# EasyEDA schematic 1-Schematic_New Project.json
TITLE: Sheet_1; REV: 1.0; Date: 2025-03-11; Sheet: 1/1; Company: Your Company
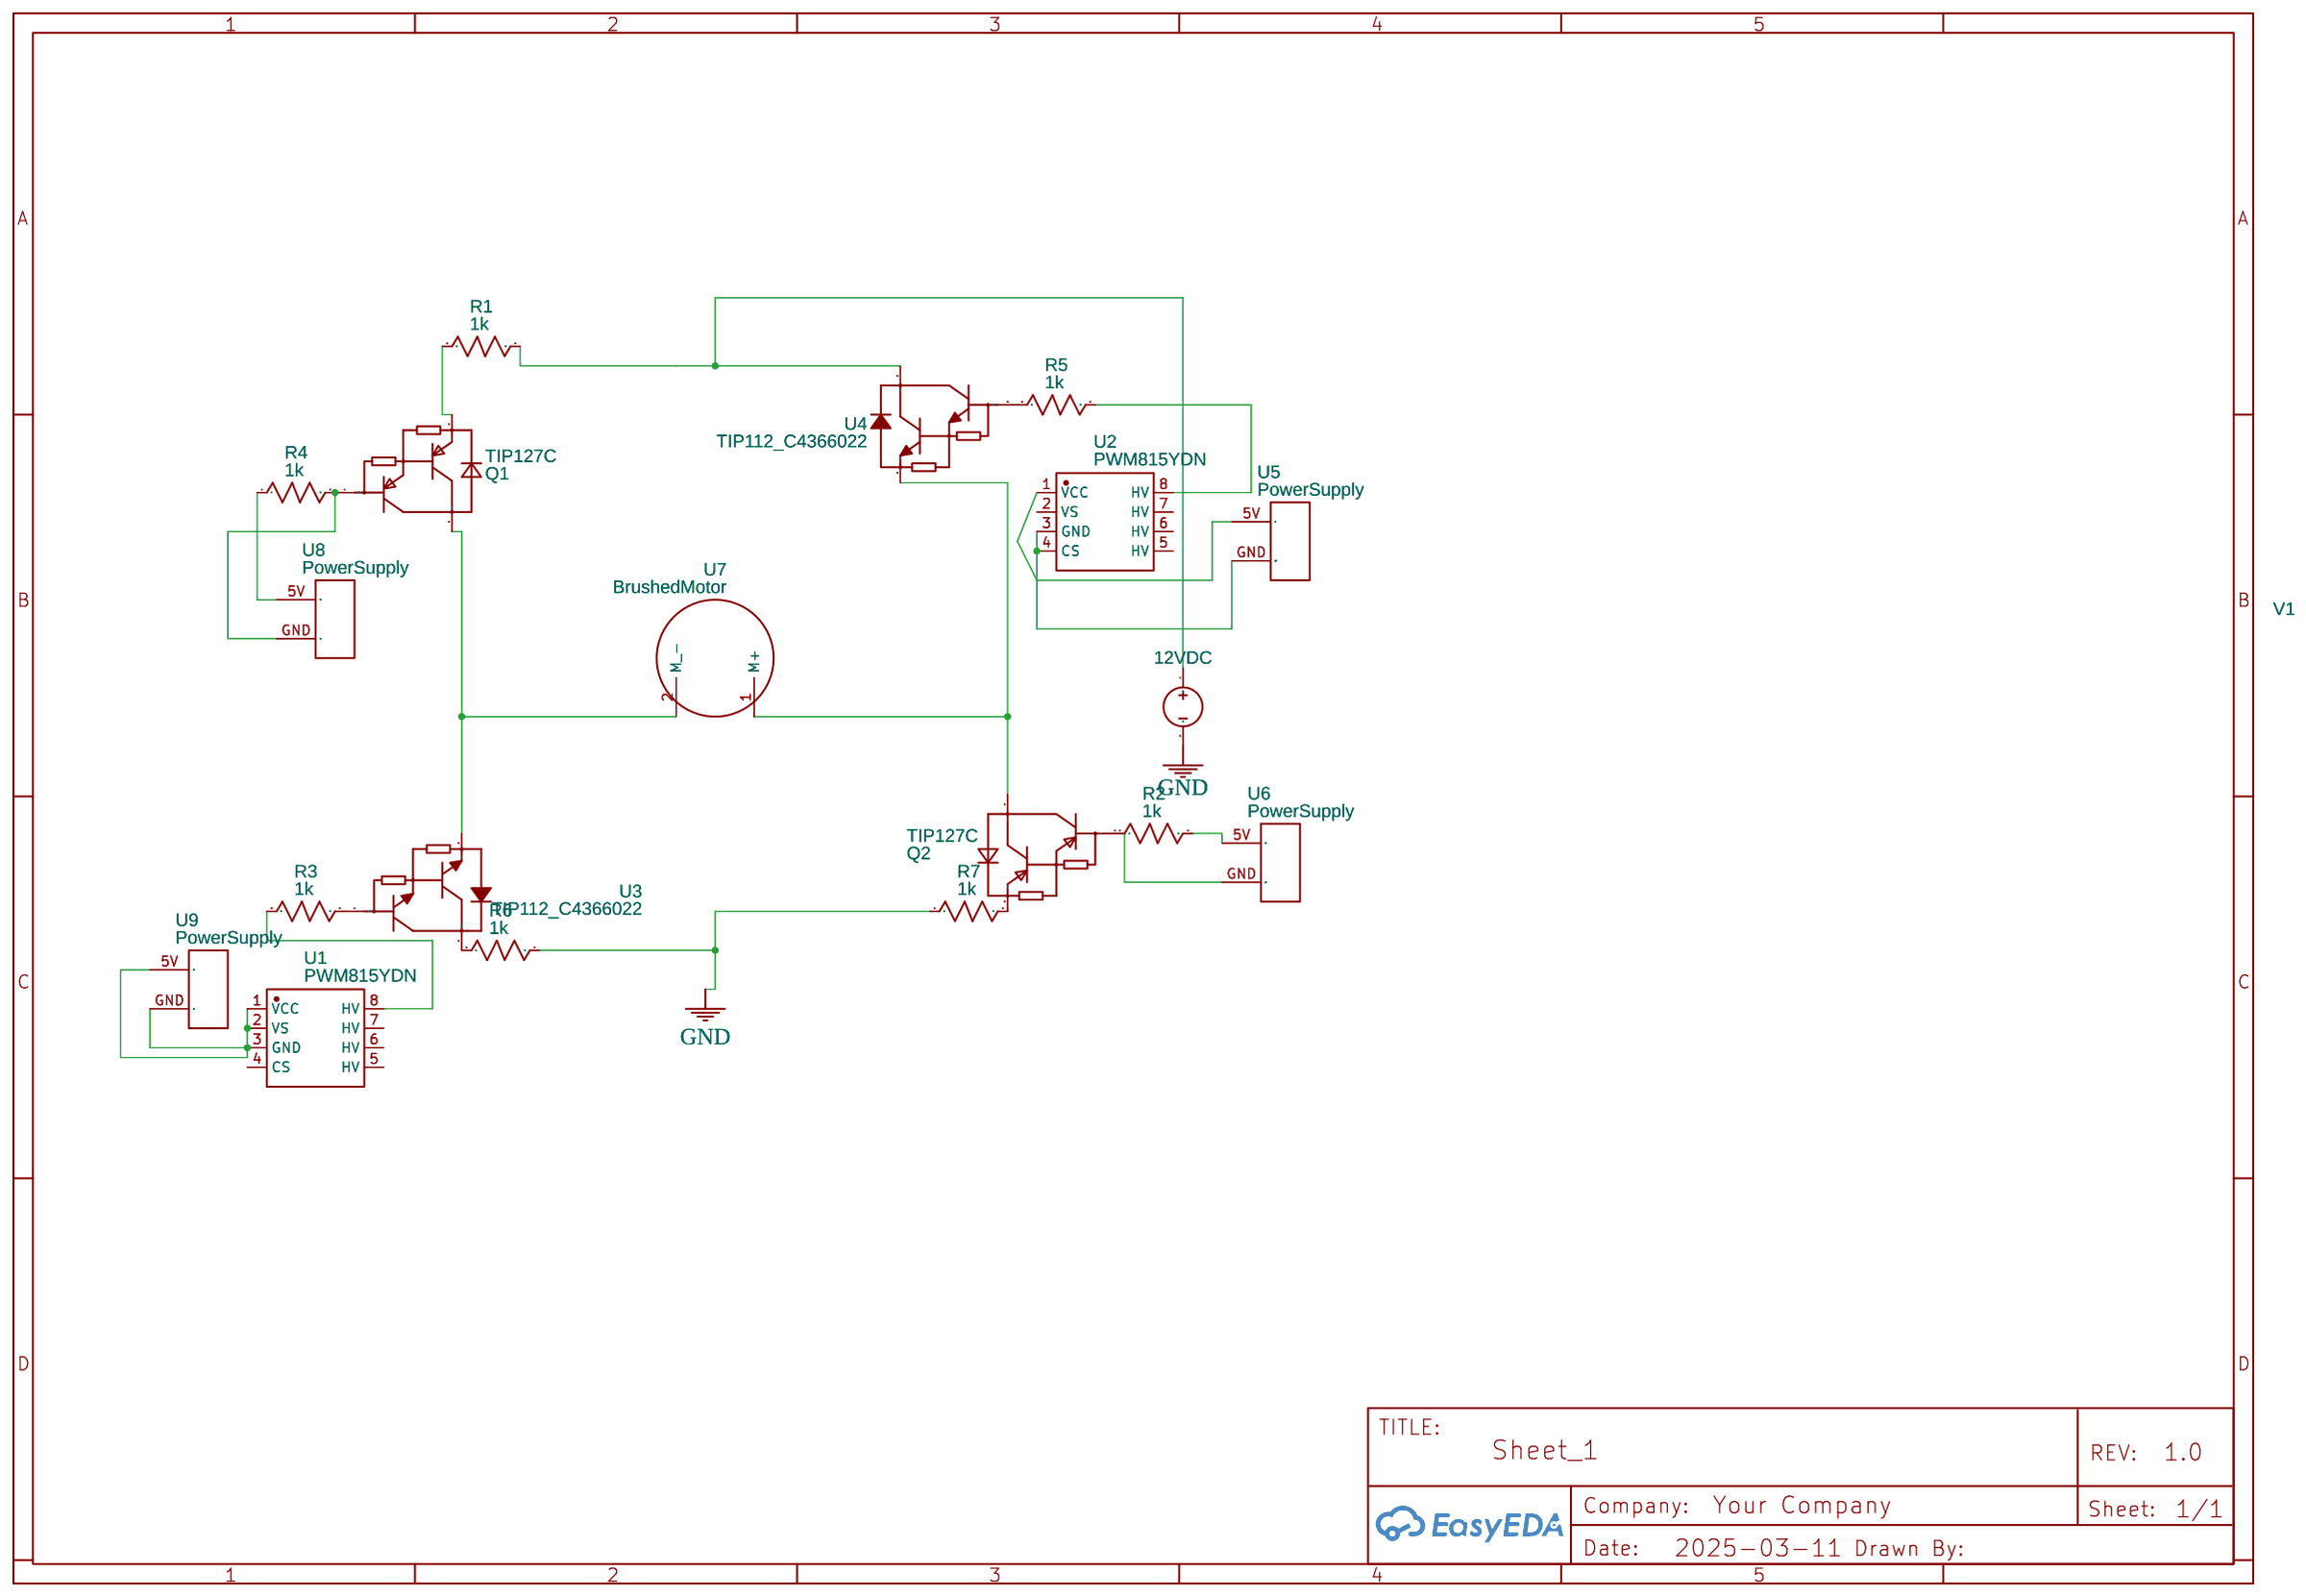
[diagram p0: schematic sheet]

## Parts
Q1  TIP127C  [TO-220-3_L10.0-W4.5-P2.54-L]
Q2  TIP127C  [TO-220-3_L10.0-W4.5-P2.54-L]
R1  1k  [R0603]
R2  1k  [R0603]
R3  1k  [R0603]
R4  1k  [R0603]
R5  1k  [R0603]
R6  1k  [R0603]
R7  1k  [R0603]
U1  PWM815YDN  [SOP-8_L5.0-W4.4-P1.27-LS6.0-BL]
U2  PWM815YDN  [SOP-8_L5.0-W4.4-P1.27-LS6.0-BL]
U3  TIP112_C4366022  [TO-220-3_L10.0-W4.6-P2.54-L]
U4  TIP112_C4366022  [TO-220-3_L10.0-W4.6-P2.54-L]
U5  PowerSupply  [POWERSUPPLY]
U6  PowerSupply  [POWERSUPPLY]
U7  BrushedMotor  [BRUSHED_MOTOR]
U8  PowerSupply  [POWERSUPPLY]
U9  PowerSupply  [POWERSUPPLY]
V1  12VDC  [HDR1X2]

## Library data of the parts
Q1 Q2 = TIP127C: Contributor: LCSC; Supplier: LCSC; Supplier Part: C438778; Manufacturer: FeiHong(飞虹); JLCPCB Part Class: Extended Part
R1-R7 = R_0603_US: Contributor: LCEDA_Lib
U1 U2 = PWM815YDN: Contributor: lcsc; Supplier: LCSC; Supplier Part: C5353720; Manufacturer: MASPOWER(麦思浦); JLCPCB Part Class: Extended Part
U3 U4 = TIP112_C4366022: Contributor: lcsc; Supplier: LCSC; Supplier Part: C4366022; Manufacturer: TI(德州仪器); Manufacturer Part: TIP112; JLCPCB Part Class: Extended Part
U5 U6 U8 U9 = PowerSupply: Contributor: Dino Keran
U7 = BrushedMotor: Contributor: wasserwiesel
V1 = Power_Supply_12V copy: Contributor: Ajnevs

## Nets
GND: R6.2 R7.1 V1.2
Net-(Q1-1): Q1.1(B) R4.2 U8.GND
Net-(Q1-2): Q1.2(C) U3.3(E) U7.2(M -)
Net-(Q1-3): Q1.3(E) R1.1
Net-(Q2-1): Q2.1(B) U6.GND
Net-(Q2-2): Q2.2(C) U4.3(E) U7.1(M+)
Net-(Q2-3): Q2.3(E) R7.2
Net-(R1-2): R1.2 U4.2(C) V1.1
Net-(R2-2): R2.2 U6.5V
Net-(R3-1): R3.1 U1.8(HV)
Net-(R3-2): R3.2 U3.1(B)
Net-(R4-1): R4.1 U8.5V
Net-(R5-1): R5.1 U4.1(B)
Net-(R5-2): R5.2 U2.8(HV)
Net-(R6-1): R6.1 U3.2(C)
Net-(U1-1): U1.1(VCC) U1.2(VS) U1.3(GND) U9.5V U9.GND
Net-(U2-1): U2.1(VCC) U5.5V
Net-(U2-3): U2.3(GND) U2.4(CS) U5.GND

Not connected (* = marked no-connect by the designer): R2 1; U1 4(CS) 5(HV) 6(HV) 7(HV); U2 2(VS) 5(HV) 6(HV) 7(HV)
